# EAGLE schematic PiPanel (EAGLE 6.6.0)

## Sheet 1 of 2
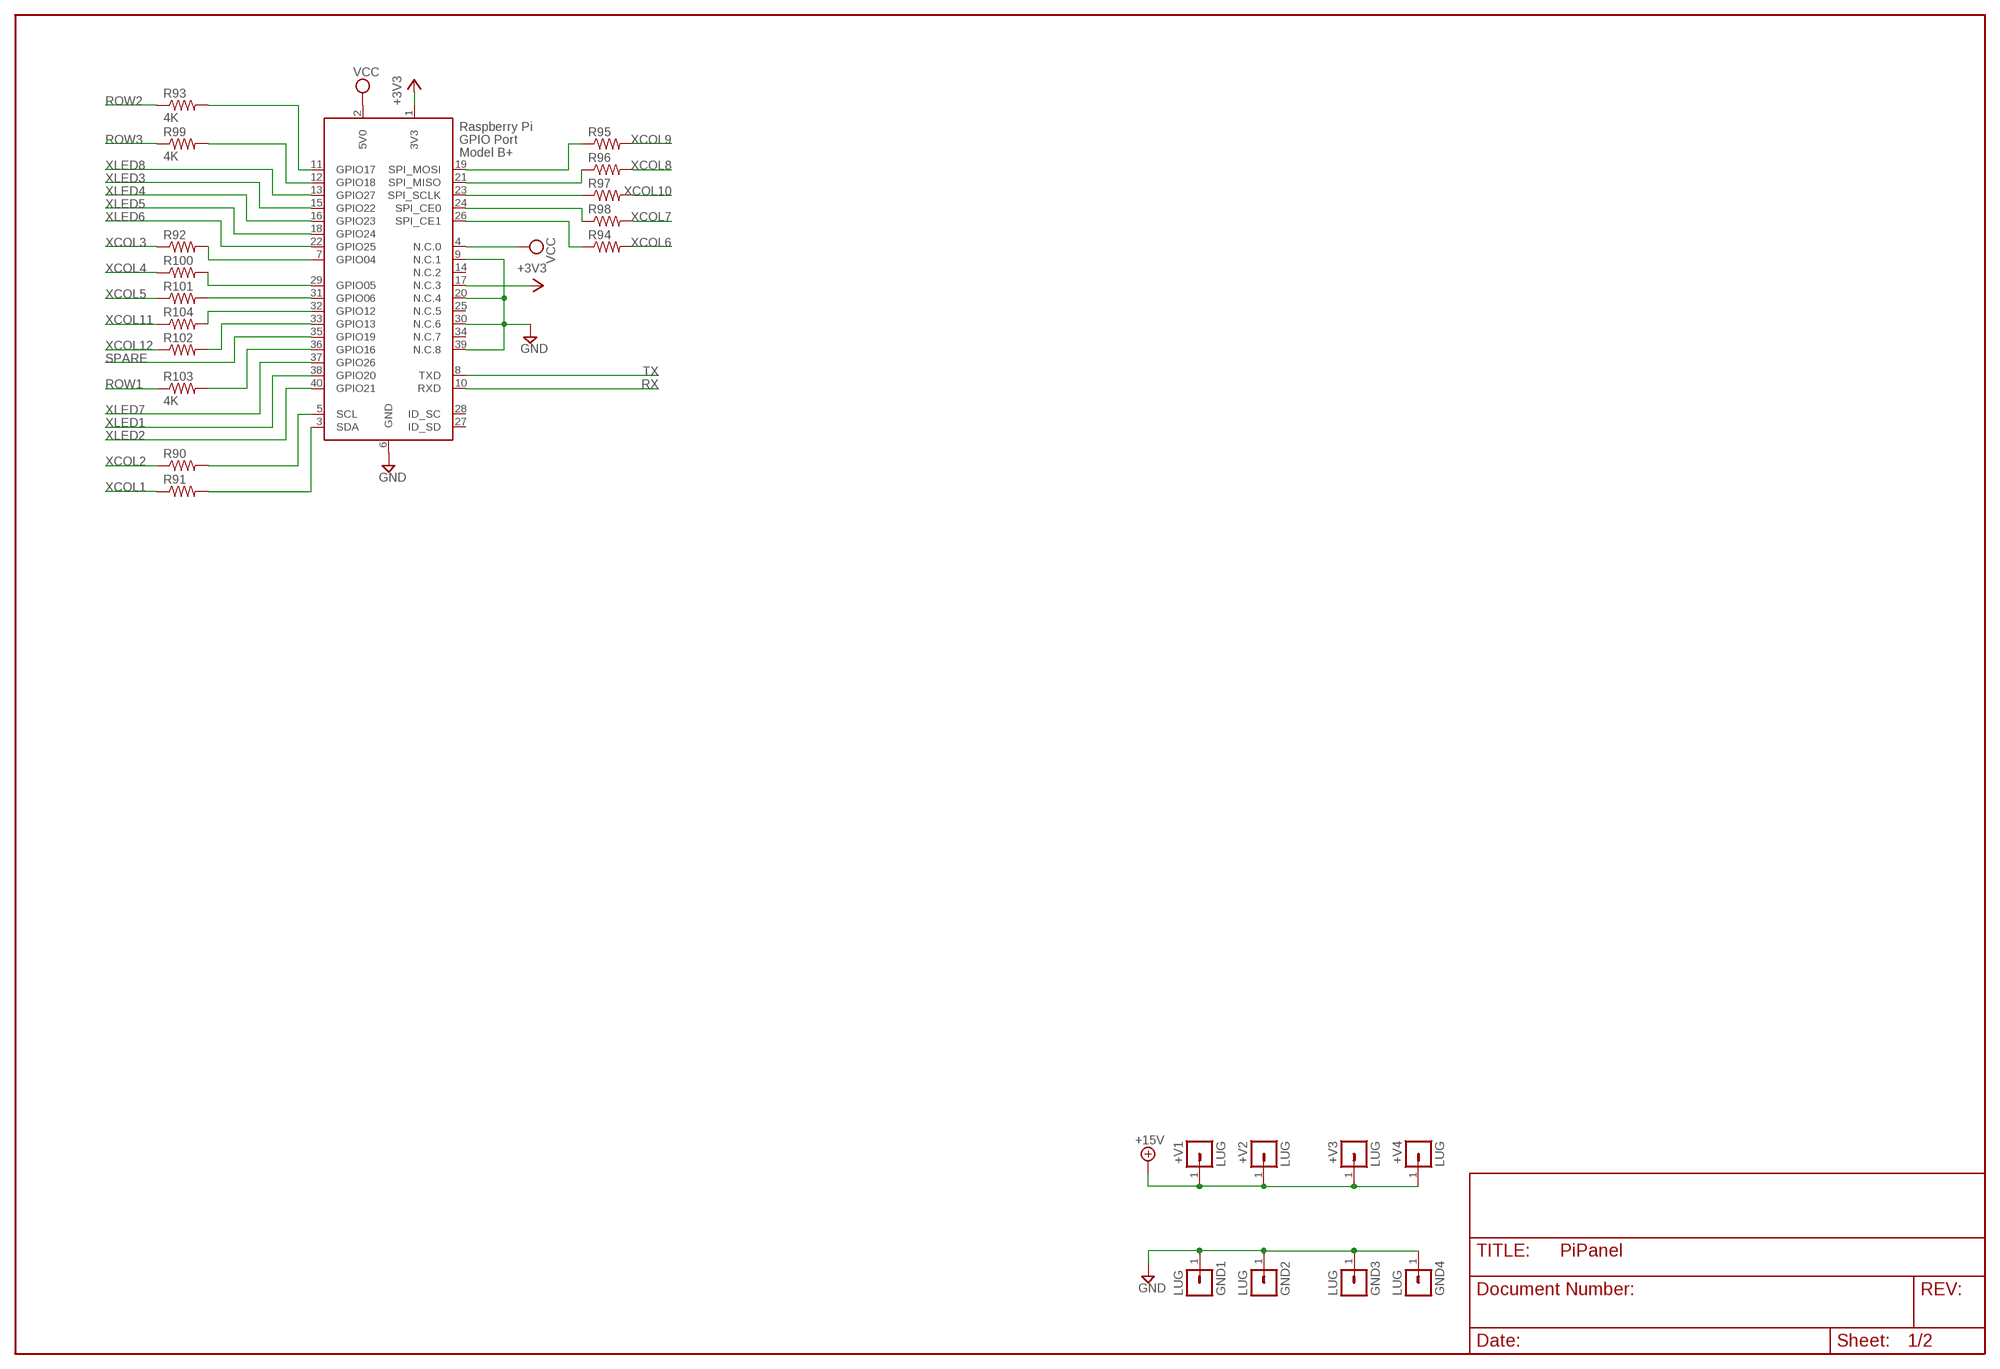
[diagram p0: schematic, sheet 1]

### Parts
+V1  LUG  [SPADELUG]
+V2  LUG  [SPADELUG]
+V3  LUG  [SPADELUG]
+V4  LUG  [SPADELUG]
GND1  LUG  [SPADELUG]
GND2  LUG  [SPADELUG]
GND3  LUG  [SPADELUG]
GND4  LUG  [SPADELUG]
R90  R-US_0207/10  [0207/10]
R91  R-US_0207/10  [0207/10]
R92  R-US_0207/10  [0207/10]
R93  4K  R-US_0207/10  [0207/10]
R94  R-US_0207/10  [0207/10]
R95  R-US_0207/10  [0207/10]
R96  R-US_0207/10  [0207/10]
R97  R-US_0207/10  [0207/10]
R98  R-US_0207/10  [0207/10]
R99  4K  R-US_0207/10  [0207/10]
R100  R-US_0207/10  [0207/10]
R101  R-US_0207/10  [0207/10]
R102  R-US_0207/10  [0207/10]
R103  4K  R-US_0207/10  [0207/10]
R104  R-US_0207/10  [0207/10]
X1  RASPI_BOARD_B+_F  [RASPI_BOARD_B+_FULL]

### Nets
+3V3: X1.1(3V3) X1.17(N.C.3)
+15V [supply]: +V1.1 +V2.1 +V3.1 +V4.1
GND [supply]: GND1.1 GND2.1 GND3.1 GND4.1 X1.6(GND) X1.9(N.C.1) X1.20(N.C.4) X1.30(N.C.6) X1.39(N.C.8) ; also sheet 2
N$179: R91.2 X1.3(SDA)
N$180: R90.2 X1.5(SCL)
N$181: R92.2 X1.7(GPIO04)
N$182: R93.2 X1.11(GPIO17)
N$183: R94.1 X1.26(SPI_CE1)
N$184: R95.1 X1.19(SPI_MOSI)
N$185: R96.1 X1.21(SPI_MISO)
N$186: R97.1 X1.23(SPI_SCLK)
N$187: R98.1 X1.24(SPI_CE0)
N$188: R99.2 X1.12(GPIO18)
N$189: R104.2 X1.32(GPIO12)
N$190: R102.2 X1.33(GPIO13)
N$191: R100.2 X1.29(GPIO05)
N$192: R101.2 X1.31(GPIO06)
N$194: R103.2 X1.36(GPIO16)
ROW1: R103.1
ROW2: R93.1
ROW3: R99.1
RX: X1.10(RXD)
SPARE: X1.35(GPIO19)
TX: X1.8(TXD)
VCC: X1.2(5V0) X1.4(N.C.0)
XCOL1: R91.1 ; also sheet 2
XCOL2: R90.1 ; also sheet 2
XCOL3: R92.1 ; also sheet 2
XCOL4: R100.1 ; also sheet 2
XCOL5: R101.1 ; also sheet 2
XCOL6: R94.2 ; also sheet 2
XCOL7: R98.2 ; also sheet 2
XCOL8: R96.2 ; also sheet 2
XCOL9: R95.2 ; also sheet 2
XCOL10: R97.2 ; also sheet 2
XCOL11: R104.1 ; also sheet 2
XCOL12: R102.1 ; also sheet 2
XLED1: X1.38(GPIO20) ; also sheet 2
XLED2: X1.40(GPIO21) ; also sheet 2
XLED3: X1.15(GPIO22) ; also sheet 2
XLED4: X1.16(GPIO23) ; also sheet 2
XLED5: X1.18(GPIO24) ; also sheet 2
XLED6: X1.22(GPIO25) ; also sheet 2
XLED7: X1.37(GPIO26) ; also sheet 2
XLED8: X1.13(GPIO27) ; also sheet 2
Unconnected: X1.14(N.C.2) X1.25(N.C.5) X1.27(ID_SD) X1.28(ID_SC) X1.34(N.C.7)

## Sheet 2 of 2
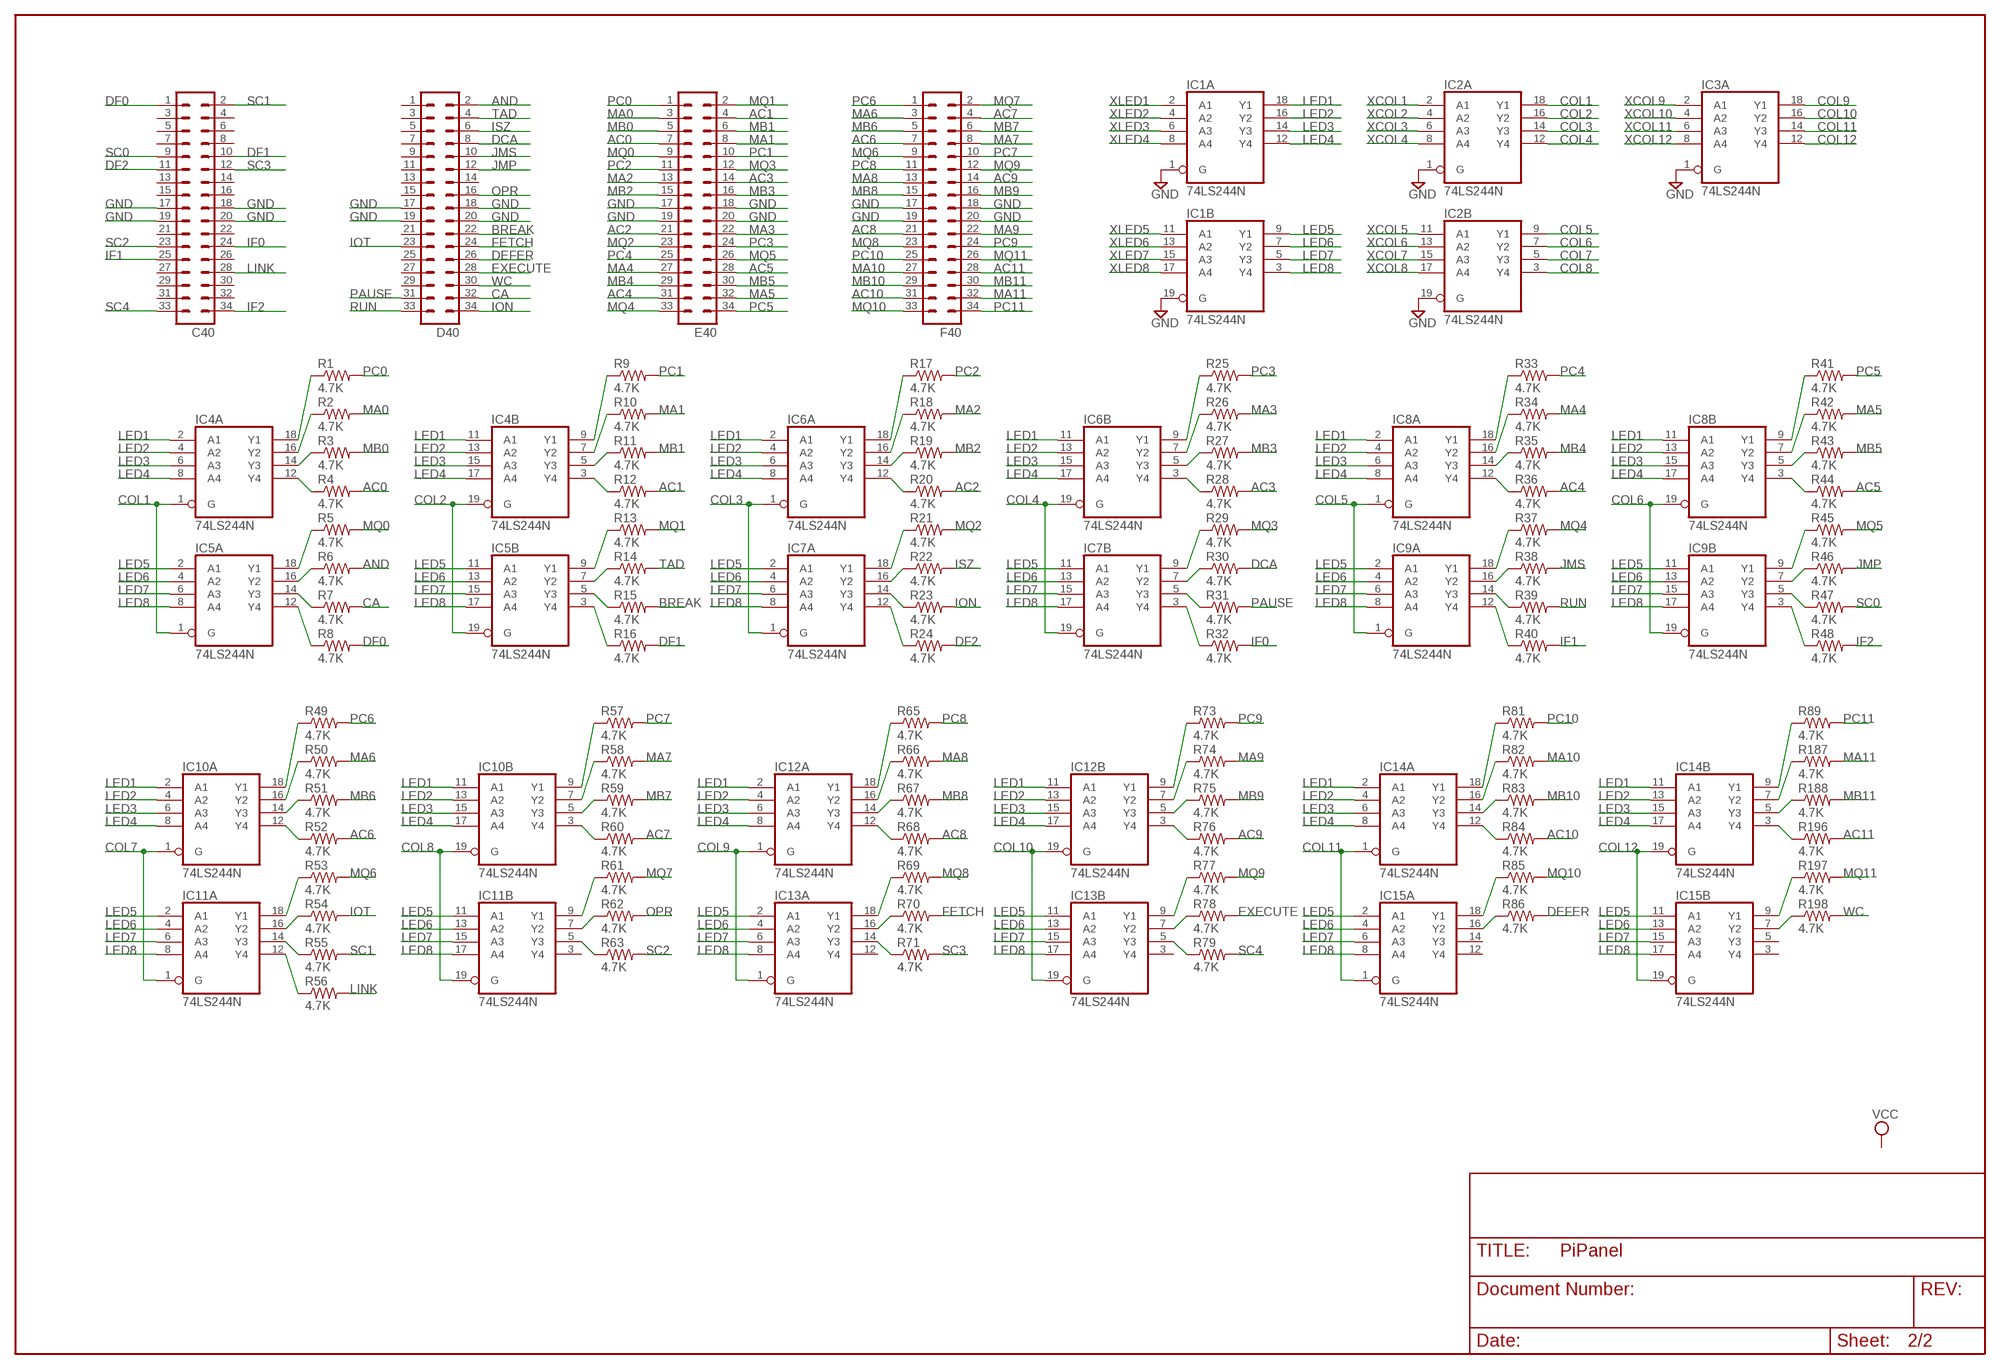
[diagram p1: schematic, sheet 2]

### Parts
C40  MA17-2  [MA17-2]
D40  MA17-2  [MA17-2]
E40  MA17-2  [MA17-2]
F40  MA17-2  [MA17-2]
IC1  74LS244N  [DIL20]
IC2  74LS244N  [DIL20]
IC3  74LS244N  [DIL20]
IC4  74LS244N  [DIL20]
IC5  74LS244N  [DIL20]
IC6  74LS244N  [DIL20]
IC7  74LS244N  [DIL20]
IC8  74LS244N  [DIL20]
IC9  74LS244N  [DIL20]
IC10  74LS244N  [DIL20]
IC11  74LS244N  [DIL20]
IC12  74LS244N  [DIL20]
IC13  74LS244N  [DIL20]
IC14  74LS244N  [DIL20]
IC15  74LS244N  [DIL20]
R1  4.7K  R-US_0207/10  [0207/10]
R2  4.7K  R-US_0207/10  [0207/10]
R3  4.7K  R-US_0207/10  [0207/10]
R4  4.7K  R-US_0207/10  [0207/10]
R5  4.7K  R-US_0207/10  [0207/10]
R6  4.7K  R-US_0207/10  [0207/10]
R7  4.7K  R-US_0207/10  [0207/10]
R8  4.7K  R-US_0207/10  [0207/10]
R9  4.7K  R-US_0207/10  [0207/10]
R10  4.7K  R-US_0207/10  [0207/10]
R11  4.7K  R-US_0207/10  [0207/10]
R12  4.7K  R-US_0207/10  [0207/10]
R13  4.7K  R-US_0207/10  [0207/10]
R14  4.7K  R-US_0207/10  [0207/10]
R15  4.7K  R-US_0207/10  [0207/10]
R16  4.7K  R-US_0207/10  [0207/10]
R17  4.7K  R-US_0207/10  [0207/10]
R18  4.7K  R-US_0207/10  [0207/10]
R19  4.7K  R-US_0207/10  [0207/10]
R20  4.7K  R-US_0207/10  [0207/10]
R21  4.7K  R-US_0207/10  [0207/10]
R22  4.7K  R-US_0207/10  [0207/10]
R23  4.7K  R-US_0207/10  [0207/10]
R24  4.7K  R-US_0207/10  [0207/10]
R25  4.7K  R-US_0207/10  [0207/10]
R26  4.7K  R-US_0207/10  [0207/10]
R27  4.7K  R-US_0207/10  [0207/10]
R28  4.7K  R-US_0207/10  [0207/10]
R29  4.7K  R-US_0207/10  [0207/10]
R30  4.7K  R-US_0207/10  [0207/10]
R31  4.7K  R-US_0207/10  [0207/10]
R32  4.7K  R-US_0207/10  [0207/10]
R33  4.7K  R-US_0207/10  [0207/10]
R34  4.7K  R-US_0207/10  [0207/10]
R35  4.7K  R-US_0207/10  [0207/10]
R36  4.7K  R-US_0207/10  [0207/10]
R37  4.7K  R-US_0207/10  [0207/10]
R38  4.7K  R-US_0207/10  [0207/10]
R39  4.7K  R-US_0207/10  [0207/10]
R40  4.7K  R-US_0207/10  [0207/10]
R41  4.7K  R-US_0207/10  [0207/10]
R42  4.7K  R-US_0207/10  [0207/10]
R43  4.7K  R-US_0207/10  [0207/10]
R44  4.7K  R-US_0207/10  [0207/10]
R45  4.7K  R-US_0207/10  [0207/10]
R46  4.7K  R-US_0207/10  [0207/10]
R47  4.7K  R-US_0207/10  [0207/10]
R48  4.7K  R-US_0207/10  [0207/10]
R49  4.7K  R-US_0207/10  [0207/10]
R50  4.7K  R-US_0207/10  [0207/10]
R51  4.7K  R-US_0207/10  [0207/10]
R52  4.7K  R-US_0207/10  [0207/10]
R53  4.7K  R-US_0207/10  [0207/10]
R54  4.7K  R-US_0207/10  [0207/10]
R55  4.7K  R-US_0207/10  [0207/10]
R56  4.7K  R-US_0207/10  [0207/10]
R57  4.7K  R-US_0207/10  [0207/10]
R58  4.7K  R-US_0207/10  [0207/10]
R59  4.7K  R-US_0207/10  [0207/10]
R60  4.7K  R-US_0207/10  [0207/10]
R61  4.7K  R-US_0207/10  [0207/10]
R62  4.7K  R-US_0207/10  [0207/10]
R63  4.7K  R-US_0207/10  [0207/10]
R65  4.7K  R-US_0207/10  [0207/10]
R66  4.7K  R-US_0207/10  [0207/10]
R67  4.7K  R-US_0207/10  [0207/10]
R68  4.7K  R-US_0207/10  [0207/10]
R69  4.7K  R-US_0207/10  [0207/10]
R70  4.7K  R-US_0207/10  [0207/10]
R71  4.7K  R-US_0207/10  [0207/10]
R73  4.7K  R-US_0207/10  [0207/10]
R74  4.7K  R-US_0207/10  [0207/10]
R75  4.7K  R-US_0207/10  [0207/10]
R76  4.7K  R-US_0207/10  [0207/10]
R77  4.7K  R-US_0207/10  [0207/10]
R78  4.7K  R-US_0207/10  [0207/10]
R79  4.7K  R-US_0207/10  [0207/10]
R81  4.7K  R-US_0207/10  [0207/10]
R82  4.7K  R-US_0207/10  [0207/10]
R83  4.7K  R-US_0207/10  [0207/10]
R84  4.7K  R-US_0207/10  [0207/10]
R85  4.7K  R-US_0207/10  [0207/10]
R86  4.7K  R-US_0207/10  [0207/10]
R89  4.7K  R-US_0207/10  [0207/10]
R187  4.7K  R-US_0207/10  [0207/10]
R188  4.7K  R-US_0207/10  [0207/10]
R196  4.7K  R-US_0207/10  [0207/10]
R197  4.7K  R-US_0207/10  [0207/10]
R198  4.7K  R-US_0207/10  [0207/10]

### Nets
AC0: E40.7 R4.2
AC1: E40.4 R12.2
AC2: E40.21 R20.2
AC3: E40.14 R28.2
AC4: E40.31 R36.2
AC5: E40.28 R44.2
AC6: F40.7 R52.2
AC7: F40.4 R60.2
AC8: F40.21 R68.2
AC9: F40.14 R76.2
AC10: F40.31 R84.2
AC11: F40.28 R196.2
AND: D40.2 R6.2
BREAK: D40.22 R15.2
CA: D40.32 R7.2
COL1: IC2.18(A:Y1) IC4.1(A:G) IC5.1(A:G)
COL2: IC2.16(A:Y2) IC4.19(B:G) IC5.19(B:G)
COL3: IC2.14(A:Y3) IC6.1(A:G) IC7.1(A:G)
COL4: IC2.12(A:Y4) IC6.19(B:G) IC7.19(B:G)
COL5: IC2.9(B:Y1) IC8.1(A:G) IC9.1(A:G)
COL6: IC2.7(B:Y2) IC8.19(B:G) IC9.19(B:G)
COL7: IC2.5(B:Y3) IC10.1(A:G) IC11.1(A:G)
COL8: IC2.3(B:Y4) IC10.19(B:G) IC11.19(B:G)
COL9: IC3.18(A:Y1) IC12.1(A:G) IC13.1(A:G)
COL10: IC3.16(A:Y2) IC12.19(B:G) IC13.19(B:G)
COL11: IC3.14(A:Y3) IC14.1(A:G) IC15.1(A:G)
COL12: IC3.12(A:Y4) IC14.19(B:G) IC15.19(B:G)
DCA: D40.8 R30.2
DEFER: D40.26 R86.2
DF0: C40.1 R8.2
DF1: C40.10 R16.2
DF2: C40.11 R24.2
EXECUTE: D40.28 R78.2
FETCH: D40.24 R70.2
GND [supply]: C40.17 C40.18 C40.19 C40.20 D40.17 D40.18 D40.19 D40.20 E40.17 E40.18 E40.19 E40.20 F40.17 F40.18 F40.19 F40.20 IC1.1(A:G) IC1.19(B:G) IC2.1(A:G) IC2.19(B:G) IC3.1(A:G) ; also sheet 1
IF0: C40.24 R32.2
IF1: C40.25 R40.2
IF2: C40.34 R48.2
ION: D40.34 R23.2
IOT: D40.23 R54.2
ISZ: D40.6 R22.2
JMP: D40.12 R46.2
JMS: D40.10 R38.2
LED1: IC1.18(A:Y1) IC4.2(A:A1) IC4.11(B:A1) IC6.2(A:A1) IC6.11(B:A1) IC8.2(A:A1) IC8.11(B:A1) IC10.2(A:A1) IC10.11(B:A1) IC12.2(A:A1) IC12.11(B:A1) IC14.2(A:A1) IC14.11(B:A1)
LED2: IC1.16(A:Y2) IC4.4(A:A2) IC4.13(B:A2) IC6.4(A:A2) IC6.13(B:A2) IC8.4(A:A2) IC8.13(B:A2) IC10.4(A:A2) IC10.13(B:A2) IC12.4(A:A2) IC12.13(B:A2) IC14.4(A:A2) IC14.13(B:A2)
LED3: IC1.14(A:Y3) IC4.6(A:A3) IC4.15(B:A3) IC6.6(A:A3) IC6.15(B:A3) IC8.6(A:A3) IC8.15(B:A3) IC10.6(A:A3) IC10.15(B:A3) IC12.6(A:A3) IC12.15(B:A3) IC14.6(A:A3) IC14.15(B:A3)
LED4: IC1.12(A:Y4) IC4.8(A:A4) IC4.17(B:A4) IC6.8(A:A4) IC6.17(B:A4) IC8.8(A:A4) IC8.17(B:A4) IC10.8(A:A4) IC10.17(B:A4) IC12.8(A:A4) IC12.17(B:A4) IC14.8(A:A4) IC14.17(B:A4)
LED5: IC1.9(B:Y1) IC5.2(A:A1) IC5.11(B:A1) IC7.2(A:A1) IC7.11(B:A1) IC9.2(A:A1) IC9.11(B:A1) IC11.2(A:A1) IC11.11(B:A1) IC13.2(A:A1) IC13.11(B:A1) IC15.2(A:A1) IC15.11(B:A1)
LED6: IC1.7(B:Y2) IC5.4(A:A2) IC5.13(B:A2) IC7.4(A:A2) IC7.13(B:A2) IC9.4(A:A2) IC9.13(B:A2) IC11.4(A:A2) IC11.13(B:A2) IC13.4(A:A2) IC13.13(B:A2) IC15.4(A:A2) IC15.13(B:A2)
LED7: IC1.5(B:Y3) IC5.6(A:A3) IC5.15(B:A3) IC7.6(A:A3) IC7.15(B:A3) IC9.6(A:A3) IC9.15(B:A3) IC11.6(A:A3) IC11.15(B:A3) IC13.6(A:A3) IC13.15(B:A3) IC15.6(A:A3) IC15.15(B:A3)
LED8: IC1.3(B:Y4) IC5.8(A:A4) IC5.17(B:A4) IC7.8(A:A4) IC7.17(B:A4) IC9.8(A:A4) IC9.17(B:A4) IC11.8(A:A4) IC11.17(B:A4) IC13.8(A:A4) IC13.17(B:A4) IC15.8(A:A4) IC15.17(B:A4)
LINK: C40.28 R56.2
MA0: E40.3 R2.2
MA1: E40.8 R10.2
MA2: E40.13 R18.2
MA3: E40.22 R26.2
MA4: E40.27 R34.2
MA5: E40.32 R42.2
MA6: F40.3 R50.2
MA7: F40.8 R58.2
MA8: F40.13 R66.2
MA9: F40.22 R74.2
MA10: F40.27 R82.2
MA11: F40.32 R187.2
MB0: E40.5 R3.2
MB1: E40.6 R11.2
MB2: E40.15 R19.2
MB3: E40.16 R27.2
MB4: E40.29 R35.2
MB5: E40.30 R43.2
MB6: F40.5 R51.2
MB7: F40.6 R59.2
MB8: F40.15 R67.2
MB9: F40.16 R75.2
MB10: F40.29 R83.2
MB11: F40.30 R188.2
MQ0: E40.9 R5.2
MQ1: E40.2 R13.2
MQ2: E40.23 R21.2
MQ3: E40.12 R29.2
MQ4: E40.33 R37.2
MQ5: E40.26 R45.2
MQ6: F40.9 R53.2
MQ7: F40.2 R61.2
MQ8: F40.23 R69.2
MQ9: F40.12 R77.2
MQ10: F40.33 R85.2
MQ11: F40.26 R197.2
N$1: IC4.18(A:Y1) R1.1
N$2: IC4.12(A:Y4) R4.1
N$3: IC4.14(A:Y3) R3.1
N$4: IC4.16(A:Y2) R2.1
N$5: IC5.18(A:Y1) R5.1
N$6: IC5.16(A:Y2) R6.1
N$7: IC5.14(A:Y3) R7.1
N$8: IC5.12(A:Y4) R8.1
N$9: IC4.9(B:Y1) R9.1
N$10: IC4.3(B:Y4) R12.1
N$11: IC4.5(B:Y3) R11.1
N$12: IC4.7(B:Y2) R10.1
N$13: IC5.9(B:Y1) R13.1
N$14: IC5.7(B:Y2) R14.1
N$15: IC5.5(B:Y3) R15.1
N$16: IC5.3(B:Y4) R16.1
N$17: IC6.18(A:Y1) R17.1
N$18: IC6.12(A:Y4) R20.1
N$19: IC6.14(A:Y3) R19.1
N$20: IC6.16(A:Y2) R18.1
N$21: IC7.18(A:Y1) R21.1
N$22: IC7.16(A:Y2) R22.1
N$23: IC7.14(A:Y3) R23.1
N$24: IC7.12(A:Y4) R24.1
N$25: IC6.9(B:Y1) R25.1
N$26: IC6.3(B:Y4) R28.1
N$27: IC6.5(B:Y3) R27.1
N$28: IC6.7(B:Y2) R26.1
N$29: IC7.9(B:Y1) R29.1
N$30: IC7.7(B:Y2) R30.1
N$31: IC7.5(B:Y3) R31.1
N$32: IC7.3(B:Y4) R32.1
N$33: IC8.18(A:Y1) R33.1
N$34: IC8.12(A:Y4) R36.1
N$35: IC8.14(A:Y3) R35.1
N$36: IC8.16(A:Y2) R34.1
N$37: IC9.18(A:Y1) R37.1
N$38: IC9.16(A:Y2) R38.1
N$39: IC9.14(A:Y3) R39.1
N$40: IC9.12(A:Y4) R40.1
N$41: IC8.9(B:Y1) R41.1
N$42: IC8.3(B:Y4) R44.1
N$43: IC8.5(B:Y3) R43.1
N$44: IC8.7(B:Y2) R42.1
N$45: IC9.9(B:Y1) R45.1
N$46: IC9.7(B:Y2) R46.1
N$47: IC9.5(B:Y3) R47.1
N$48: IC9.3(B:Y4) R48.1
N$49: IC10.18(A:Y1) R49.1
N$50: IC10.12(A:Y4) R52.1
N$51: IC10.14(A:Y3) R51.1
N$52: IC10.16(A:Y2) R50.1
N$53: IC11.18(A:Y1) R53.1
N$54: IC11.16(A:Y2) R54.1
N$55: IC11.14(A:Y3) R55.1
N$56: IC11.12(A:Y4) R56.1
N$57: IC10.9(B:Y1) R57.1
N$58: IC10.3(B:Y4) R60.1
N$59: IC10.5(B:Y3) R59.1
N$60: IC10.7(B:Y2) R58.1
N$61: IC11.9(B:Y1) R61.1
N$62: IC11.7(B:Y2) R62.1
N$63: IC11.5(B:Y3) R63.1
N$65: IC12.18(A:Y1) R65.1
N$66: IC12.12(A:Y4) R68.1
N$67: IC12.14(A:Y3) R67.1
N$68: IC12.16(A:Y2) R66.1
N$69: IC13.18(A:Y1) R69.1
N$70: IC13.16(A:Y2) R70.1
N$71: IC13.14(A:Y3) R71.1
N$73: IC12.9(B:Y1) R73.1
N$74: IC12.3(B:Y4) R76.1
N$75: IC12.5(B:Y3) R75.1
N$76: IC12.7(B:Y2) R74.1
N$77: IC13.9(B:Y1) R77.1
N$78: IC13.7(B:Y2) R78.1
N$79: IC13.5(B:Y3) R79.1
N$81: IC14.18(A:Y1) R81.1
N$82: IC14.12(A:Y4) R84.1
N$83: IC14.14(A:Y3) R83.1
N$84: IC14.16(A:Y2) R82.1
N$85: IC15.18(A:Y1) R85.1
N$86: IC15.16(A:Y2) R86.1
N$89: IC14.9(B:Y1) R89.1
N$90: IC14.3(B:Y4) R196.1
N$91: IC14.5(B:Y3) R188.1
N$92: IC14.7(B:Y2) R187.1
N$93: IC15.9(B:Y1) R197.1
N$94: IC15.7(B:Y2) R198.1
OPR: D40.16 R62.2
PAUSE: D40.31 R31.2
PC0: E40.1 R1.2
PC1: E40.10 R9.2
PC2: E40.11 R17.2
PC3: E40.24 R25.2
PC4: E40.25 R33.2
PC5: E40.34 R41.2
PC6: F40.1 R49.2
PC7: F40.10 R57.2
PC8: F40.11 R65.2
PC9: F40.24 R73.2
PC10: F40.25 R81.2
PC11: F40.34 R89.2
RUN: D40.33 R39.2
SC0: C40.9 R47.2
SC1: C40.2 R55.2
SC2: C40.23 R63.2
SC3: C40.12 R71.2
SC4: C40.33 R79.2
TAD: D40.4 R14.2
WC: D40.30 R198.2
XCOL1: IC2.2(A:A1) ; also sheet 1
XCOL2: IC2.4(A:A2) ; also sheet 1
XCOL3: IC2.6(A:A3) ; also sheet 1
XCOL4: IC2.8(A:A4) ; also sheet 1
XCOL5: IC2.11(B:A1) ; also sheet 1
XCOL6: IC2.13(B:A2) ; also sheet 1
XCOL7: IC2.15(B:A3) ; also sheet 1
XCOL8: IC2.17(B:A4) ; also sheet 1
XCOL9: IC3.2(A:A1) ; also sheet 1
XCOL10: IC3.4(A:A2) ; also sheet 1
XCOL11: IC3.6(A:A3) ; also sheet 1
XCOL12: IC3.8(A:A4) ; also sheet 1
XLED1: IC1.2(A:A1) ; also sheet 1
XLED2: IC1.4(A:A2) ; also sheet 1
XLED3: IC1.6(A:A3) ; also sheet 1
XLED4: IC1.8(A:A4) ; also sheet 1
XLED5: IC1.11(B:A1) ; also sheet 1
XLED6: IC1.13(B:A2) ; also sheet 1
XLED7: IC1.15(B:A3) ; also sheet 1
XLED8: IC1.17(B:A4) ; also sheet 1
Unconnected: C40.3 C40.4 C40.5 C40.6 C40.7 C40.8 C40.13 C40.14 C40.15 C40.16 C40.21 C40.22 C40.26 C40.27 C40.29 C40.30 C40.31 C40.32 D40.1 D40.3 D40.5 D40.7 D40.9 D40.11 D40.13 D40.14 D40.15 D40.21 D40.25 D40.27 D40.29 IC3.3(B:Y4) IC3.5(B:Y3) IC3.7(B:Y2) IC3.9(B:Y1) IC3.11(B:A1) IC3.13(B:A2) IC3.15(B:A3) IC3.17(B:A4) IC3.19(B:G) IC11.3(B:Y4) IC13.3(B:Y4) IC13.12(A:Y4) IC15.3(B:Y4) IC15.5(B:Y3) IC15.12(A:Y4) IC15.14(A:Y3)

## Power pins joined to a net without a drawn wire
GND: IC1.10(P:GND) IC2.10(P:GND) IC3.10(P:GND) IC4.10(P:GND) IC5.10(P:GND) IC6.10(P:GND) IC7.10(P:GND) IC8.10(P:GND) IC9.10(P:GND) IC10.10(P:GND) IC11.10(P:GND) IC12.10(P:GND) IC13.10(P:GND) IC14.10(P:GND) IC15.10(P:GND)
VCC: IC1.20(P:VCC) IC2.20(P:VCC) IC3.20(P:VCC) IC4.20(P:VCC) IC5.20(P:VCC) IC6.20(P:VCC) IC7.20(P:VCC) IC8.20(P:VCC) IC9.20(P:VCC) IC10.20(P:VCC) IC11.20(P:VCC) IC12.20(P:VCC) IC13.20(P:VCC) IC14.20(P:VCC) IC15.20(P:VCC)

## Library data of the parts
+V1-+V4 GND1-GND4 = dec-con:LUG: Spade Lug
C40 D40 E40 F40 = con-lstb:MA17-2: PIN HEADER
IC1-IC15 = 74xx-us:74*244: Octal BUFFER and LINE DRIVER, 3-state
R1-R63 R65-R71 R73-R79 R81-R86 R89-R104 R187 R188 R196-R198 = rcl:R-US_: RESISTOR, American symbol
X1 = raspberrypi_bastelstube_v13:RASPI_BOARD_B+: Raspberry Pi GPIO connector with markings for the outer dimensions of the Raspberry Pi board model B+ with different sets of drill holes or mounting pads

## Net classes
1 supply: width 0.762 mm